# EasyEDA schematic PCB easyeda project.json
TITLE: Final Year Project: Home automation; REV: 1.0; Date: 2023-01-18; Sheet: 1/1; Drawn By: Omarr1999; Company: Sup Galilée
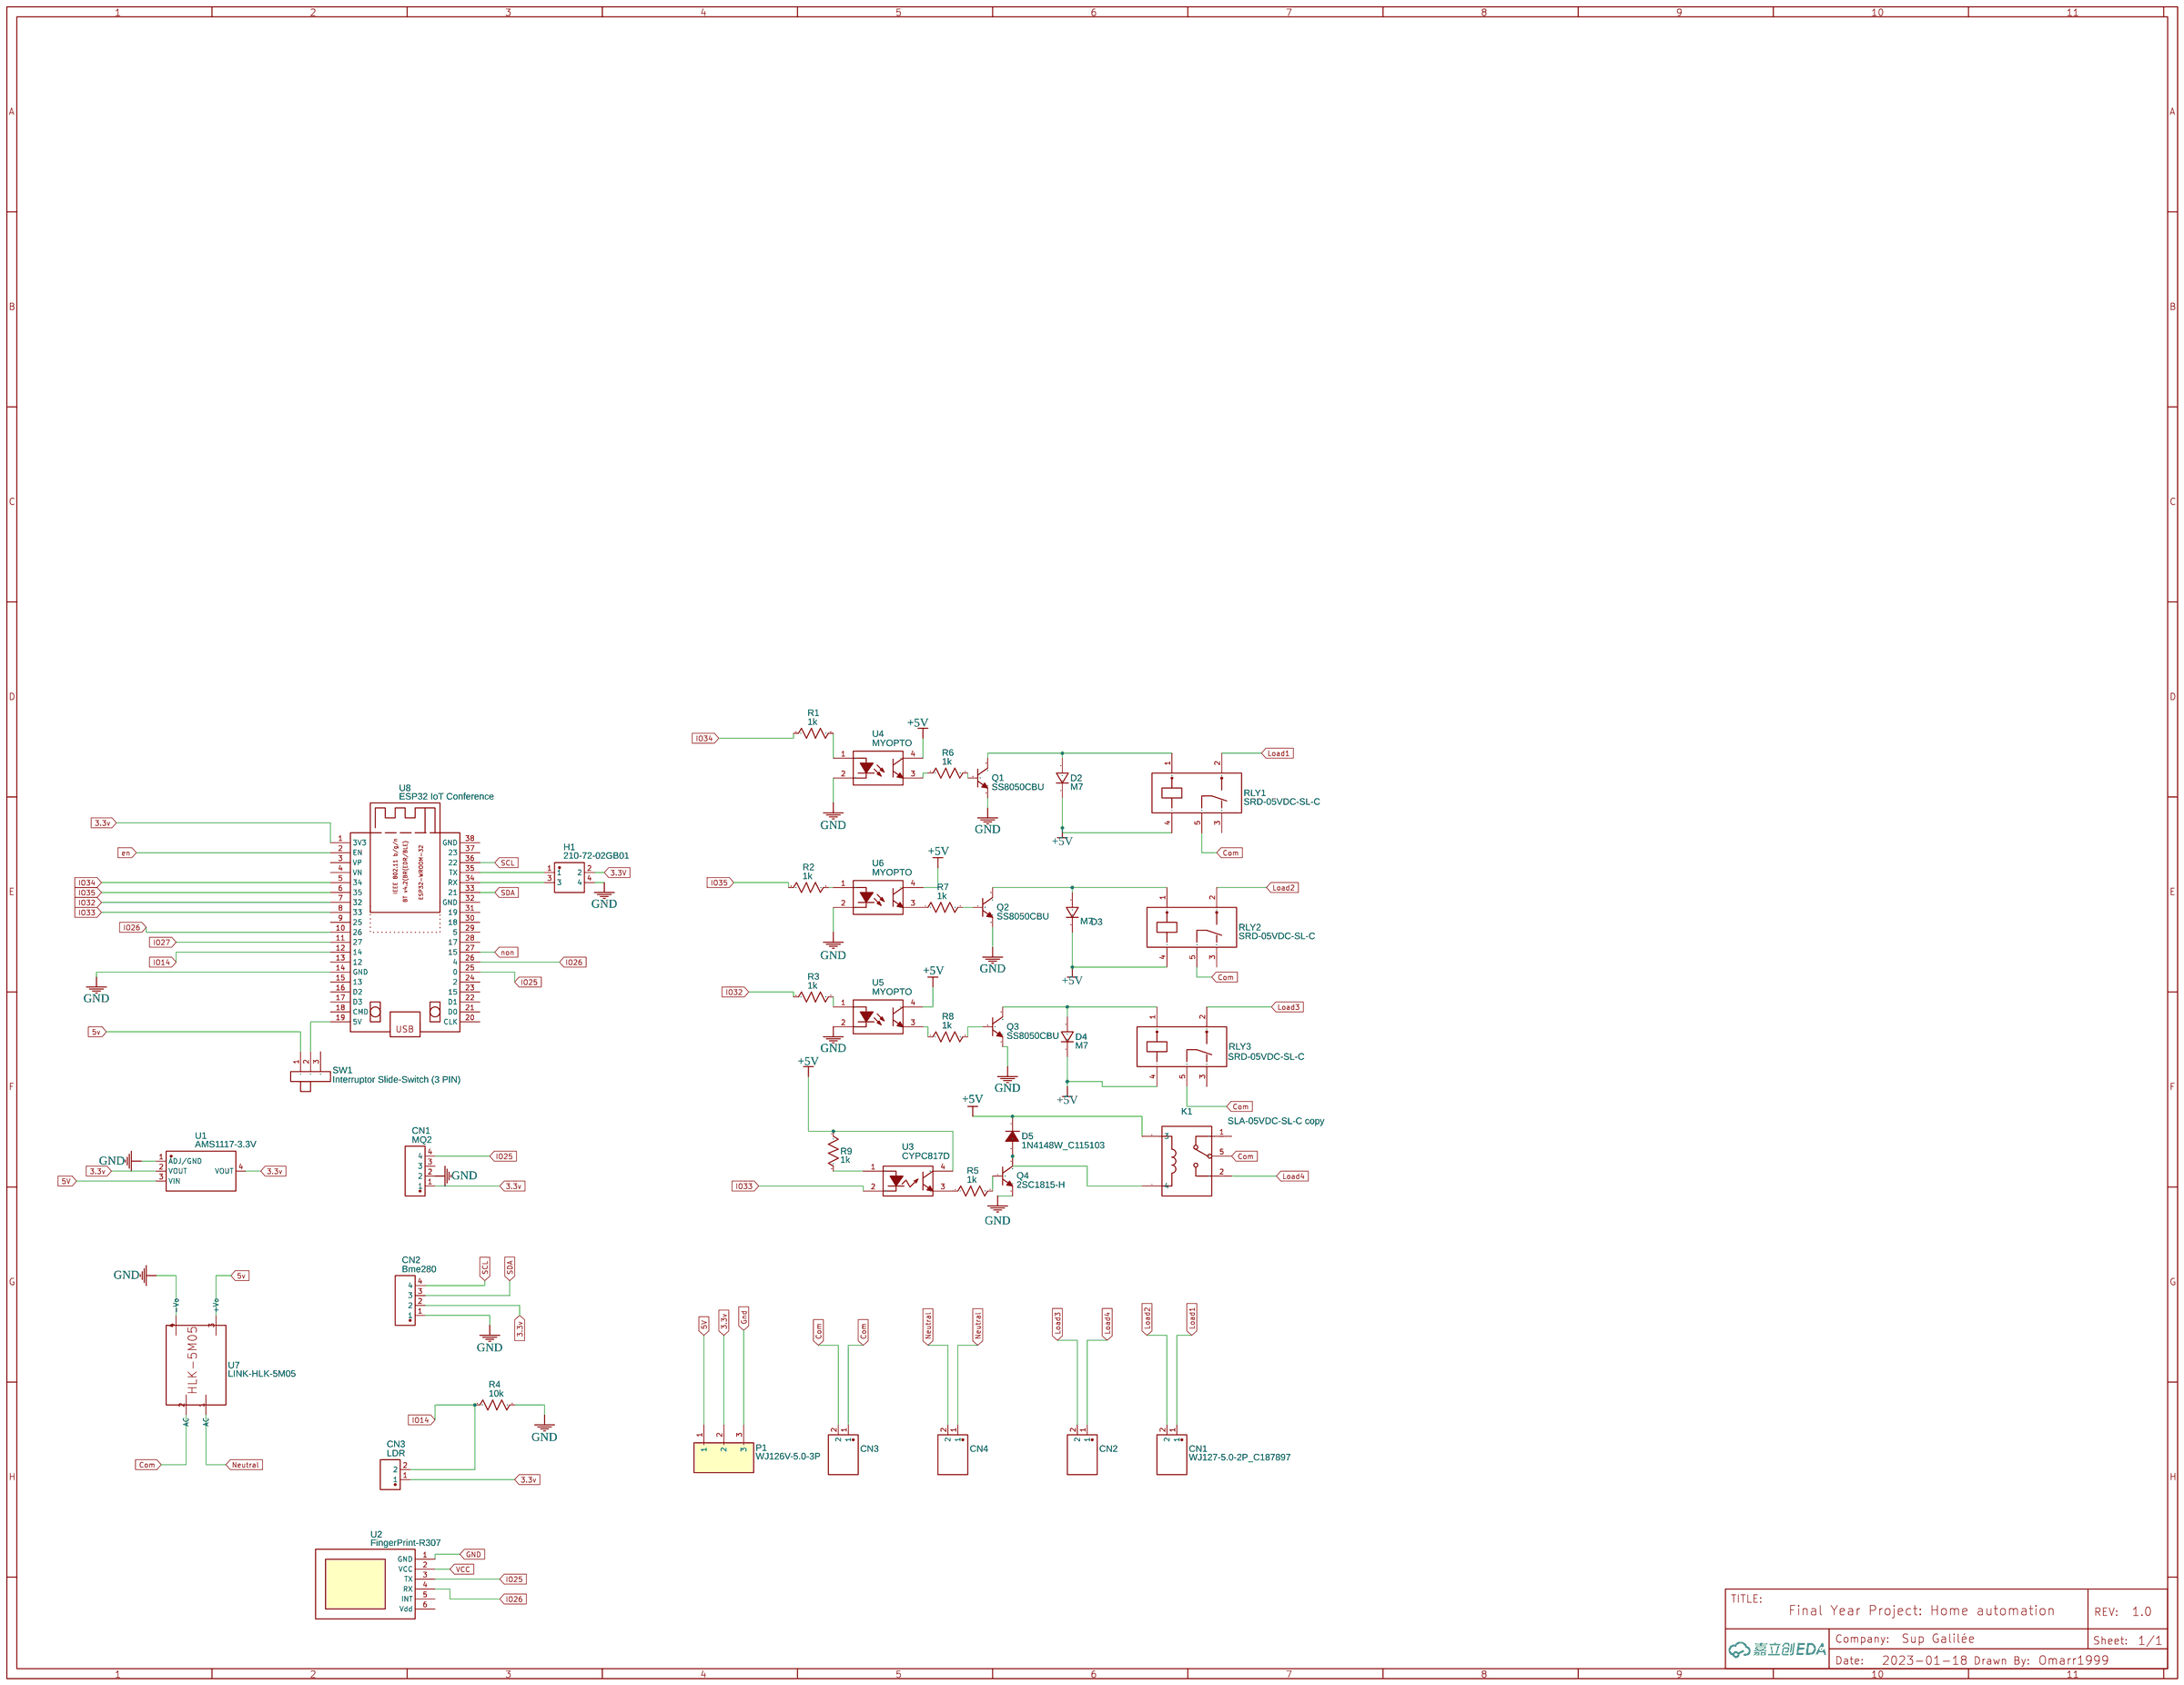
[diagram p0: schematic sheet]

## Parts
CN1  MQ2  [CONN-TH_4P-P4.00_FLY4-HEADER4]
CN1#2  WJ127-5.0-2P_C187897  [CONN-TH_2P-P5.00_WJ127-5.0-2P]
CN2  Bme280  [CONN-TH_4P-P4.00_FLY4-HEADER4]
CN2#2  WJ127-5.0-2P_C187897  [CONN-TH_2P-P5.00_WJ127-5.0-2P]
CN3  LDR  [CONN-TH_2P-P4.00_VH2-HEADER2]
CN3#2  WJ127-5.0-2P_C187897  [CONN-TH_2P-P5.00_WJ127-5.0-2P]
CN4  WJ127-5.0-2P_C187897  [CONN-TH_2P-P5.00_WJ127-5.0-2P]
D2  M7  [SMA_L4.4-W2.8-LS5.4-RD]
D3  M7  [SMA_L4.4-W2.8-LS5.4-RD]
D4  M7  [SMA_L4.4-W2.8-LS5.4-RD]
D5  1N4148W_C115103  [SOD-123_L2.8-W1.8-LS3.7-RD]
H1  210-72-02GB01  [HDR-TH_4P-P2.54-V-R2-C2-S2.54_A2541WV-2X2P]
K1  SLA-05VDC-SL-C copy  [SLA-05VDC-SL-C]
P1  WJ126V-5.0-3P  [CONN-TH_3P-P5.00_WJ126V-5.0-3P]
Q1  SS8050CBU  [TO-92-3_L4.9-W3.7-P1.27-L]
Q2  SS8050CBU  [TO-92-3_L4.9-W3.7-P1.27-L]
Q3  SS8050CBU  [TO-92-3_L4.9-W3.7-P1.27-L]
Q4  2SC1815-H  [SOT-23-3_L2.9-W1.3-P1.90-LS2.4-BR]
R1  1k  [R0603]
R2  1k  [R0603]
R3  1k  [R0603]
R4  10k  [R0603]
R5  1k  [R0603]
R6  1k  [R0603]
R7  1k  [R0603]
R8  1k  [R0603]
R9  1k  [R0603]
RLY1  SRD-05VDC-SL-C  [RELAY-TH_SRD-XXVDC-XL-C]
RLY2  SRD-05VDC-SL-C  [RELAY-TH_SRD-XXVDC-XL-C]
RLY3  SRD-05VDC-SL-C  [RELAY-TH_SRD-XXVDC-XL-C]
SW1  Interruptor Slide-Switch (3 PIN)  [INTERRUPTOR-SLIDESWITCH-3PIN]
U1  AMS1117-3.3V  [SOT-223-4_L6.5-W3.5-P2.30-LS7.0-BR]
U2  FingerPrint-R307  [SIL-6]
U3  CYPC817D  [DIP-4_L6.4-W4.6-P2.54-LS7.6-BL]
U4  MYOPTO  [FR_OPTO817C]
U5  MYOPTO  [FR_OPTO817C]
U6  MYOPTO  [FR_OPTO817C]
U7  LINK-HLK-5M05  [LINK-HLK-5M05]
U8  ESP32 IoT Conference  [ESP32DEVKITCV4]

## Library data of the parts
CN1 CN2 = FLY4-HEADER4: Supplier: LCSC; Supplier Part: C9900006105; Manufacturer Part: FLY4-Header4; JLCPCB Part Class: Extended Part; Contributor: LCSC
CN1#2 CN2#2 CN3#2 CN4 = WJ127-5.0-2P_C187897: Contributor: LCSC; Supplier: LCSC; Supplier Part: C187897; Manufacturer: Ningbo Kangnex Elec; Manufacturer Part: WJ127-5.0-2P; link: https://lcsc.com/eda_search?q=C187897&%26type=1&ref=editor
CN3 = VH2-HEADER2: Supplier: LCSC; Supplier Part: C9900011009; Manufacturer: null; Manufacturer Part: VH2-Header2; Contributor: LCSC; JLCPCB Part Class: Extended Part
D2-D4 = M7: Supplier: LCSC; Supplier Part: C266550; Manufacturer: BORN(伯恩半导体); Contributor: LCSC; JLCPCB Part Class: Extended Part
D5 = 1N4148W_C115103: Supplier: LCSC; Manufacturer: 晶导微电子; Manufacturer Part: 1N4148W; Supplier Part: C115103; JLCPCB Part Class: Extended Part
H1 = 210-72-02GB01: Contributor: LCSC; Supplier: LCSC; Supplier Part: C402780; Manufacturer: PINREX(频锐科技); JLCPCB Part Class: Extended Part; link: https://lcsc.com/eda_search?q=C402780&%26type=1&ref=editor
K1 = SLA-05VDC-SL-C copy: Supplier: LCSC; Supplier Part: C87367; Manufacturer: Ningbo Songle Relay; Contributor: LCSC
P1 = WJ126V-5.0-3P: Supplier: LCSC; Manufacturer: KANGNEX(康奈克斯电气); Supplier Part: C8401; JLCPCB Part Class: Extended Part; link: https://lcsc.com/eda_search?q=C8401&%26type=1&ref=editor
Q1-Q3 = SS8050CBU: Supplier: LCSC; Supplier Part: C896927; Manufacturer: onsemi(安森美); Contributor: LCSC; JLCPCB Part Class: Extended Part
Q4 = 2SC1815-H: Supplier: LCSC; Supplier Part: C489158; Manufacturer: KEXIN; Contributor: LCSC; JLCPCB Part Class: Extended Part
R1-R9 = R_0603_US: Contributor: LCEDA_Lib
RLY1-RLY3 = SRD-05VDC-SL-C: Supplier: LCSC; Manufacturer: 松乐; Supplier Part: C35449; JLCPCB Part Class: Extended Part
SW1 = Interruptor Slide-Switch (3 PIN): Manufacturer: A+A Technology Co.,Ltd; link: https://www.aliexpress.com/item/32964400942.html?spm=a2g0s.9042311.0.0.27424c4dc1ZKZt; Contributor: gsipos
U1 = AMS1117-3.3V: Contributor: LCSC; Supplier: LCSC; Supplier Part: C2688239; Manufacturer: WPMtek(维攀微); JLCPCB Part Class: Extended Part; link: https://lcsc.com/eda_search?q=C2688239&%26type=1&ref=editor
U2 = FingerPrint-R307: Manufacturer Part: R307; Contributor: chrislian; subpart_no: 1
U3 = CYPC817D: Supplier: LCSC; Supplier Part: C3018787; Manufacturer: OCIC(卓睿科); link: https://atta.szlcsc.com/upload/public/pdf/source/20220525/B2F38D32EF82C4BA6B4D58C0D80ABA7E.pdf; Contributor: lcsc
U4-U6 = MYOPTO: Manufacturer Part: fr_Opto817C; Contributor: fonta
U7 = LINK-HLK-5M05: Contributor: byrongio1992
U8 = ESP32 IoT Conference: Manufacturer: AZ-DELIVERY; Manufacturer Part: ESP32 Dev Kit C V4; link: https://www.az-delivery.de/products/esp-32-dev-kit-c-v4; Contributor: NullString1

## Nets
3.3v: CN1.1 CN2.2 CN3.1 P1.2 U1.2(VOUT) U1.4(VOUT) U8.1(3V3)
3.3V: H1.2
5v: SW1.1 U7.3(+Vo)
5V: P1.1 U1.3(VIN)
+5V: D2.1 D3.1 D4.1 D5.1(K) K1.3 R9.1 RLY1.4 RLY2.4 RLY3.4 U3.4(COL) U4.4 U5.4 U6.4
GND: CN1.2 CN2.1 H1.4 Q1.1(E) Q2.1(E) Q3.1(E) Q4.2(E) R4.1 U1.1(ADJ/GND) U2.1(GND) U4.2 U5.2 U6.2 U7.4(-Vo) U8.14(GND)
Gnd: P1.3
VCC: U2.2(VCC)
Com: CN3#2.1 CN3#2.2 K1.5 RLY1.5 RLY2.5 RLY3.5 U7.2(AC)
en: U8.2(EN)
IO14: CN3.2 R4.2 U8.12(14)
IO25: CN1.4 U2.3(TX) U8.25(0)
IO26: U2.4(RX) U8.10(26) U8.26(4)
IO27: U8.11(27)
IO32: R3.1 U8.7(32)
IO33: U3.2(CAT) U8.8(33)
IO34: R1.1 U8.5(34)
IO35: R2.1 U8.6(35)
Load1: CN1#2.1 RLY1.2
Load2: CN1#2.2 RLY2.2
Load3: CN2#2.2 RLY3.2
Load4: CN2#2.1 K1.2
Neutral: CN4.1 CN4.2 U7.1(AC)
non: U8.27(15)
SCL: CN2.4 U8.36(22)
SDA: CN2.3 U8.33(21)
Net-(D2-2): D2.2 Q1.3(C) RLY1.1
Net-(D3-2): D3.2 Q2.3(C) RLY2.1
Net-(D4-2): D4.2 Q3.3(C) RLY3.1
Net-(D5-2): D5.2(A) K1.4 Q4.3(C)
Net-(H1-1): H1.1 U8.35(TX)
Net-(H1-3): H1.3 U8.34(RX)
Net-(Q1-2): Q1.2(B) R6.2
Net-(Q2-2): Q2.2(B) R7.2
Net-(Q3-2): Q3.2(B) R8.2
Net-(Q4-1): Q4.1(B) R5.2
Net-(R1-2): R1.2 U4.1
Net-(R2-2): R2.2 U6.1
Net-(R3-2): R3.2 U5.1
Net-(R5-1): R5.1 U3.3(EM)
Net-(R6-1): R6.1 U4.3
Net-(R7-1): R7.1 U6.3
Net-(R8-1): R8.1 U5.3
Net-(R9-2): R9.2 U3.1(AN)
Net-(SW1-2): SW1.2 U8.19(5V)

Not connected (* = marked no-connect by the designer): CN1 3; K1 1; RLY1 3; RLY2 3; RLY3 3; SW1 3; U2 5(INT) 6(Vdd); U8 3(VP) 4(VN) 9(25) 13(12) 15(13) 16(D2) 17(D3) 18(CMD) 20(CLK) 21(D0) 22(D1) 23(15) 24(2) 28(17) 29(5) 30(18) 31(19) 32(GND) 37(23) 38(GND)
